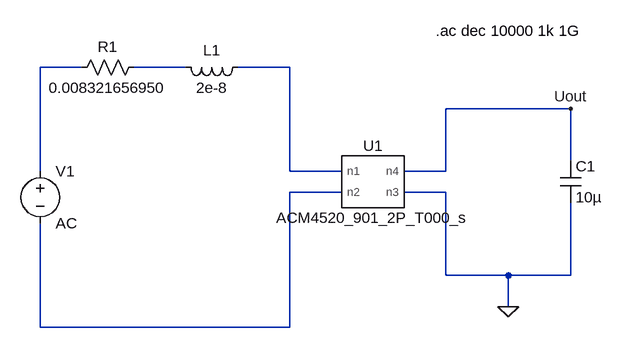
[diagram p0: schematic 01_DM-Filter_REAL.asc]
01_DM-Filter_REAL.asc, the LTspice schematic file:
Version 4
SHEET 1 1288 680
WIRE -240 -128 -304 -128
WIRE -80 -128 -160 -128
WIRE 80 -128 0 -128
WIRE 512 -64 320 -64
WIRE 512 16 512 -64
WIRE -304 32 -304 -128
WIRE 80 32 80 -128
WIRE 160 32 80 32
WIRE 320 32 320 -64
WIRE 320 32 256 32
WIRE 160 64 80 64
WIRE 320 64 256 64
WIRE 320 192 320 64
WIRE 416 192 320 192
WIRE 512 192 512 80
WIRE 512 192 416 192
WIRE 416 240 416 192
WIRE -304 272 -304 112
WIRE 80 272 80 64
WIRE 80 272 -304 272
FLAG 416 240 0
FLAG 512 -64 Uout
SYMBOL voltage -304 16 R0
SYMATTR InstName V1
SYMATTR Value AC
SYMBOL cap 496 16 R0
SYMATTR InstName C1
SYMATTR Value 10µ
SYMATTR SpiceLine V=50 Irms=0 Rser=0.0034 Lser=799p mfg="Würth Elektronik" pn="885012108022 WCAP-CSGP 1206" type="X5R"
SYMBOL res -144 -144 R90
WINDOW 0 0 56 VBottom 2
WINDOW 3 32 56 VTop 2
SYMATTR InstName R1
SYMATTR Value 0.008321656950
SYMBOL ind 16 -144 R90
WINDOW 0 5 56 VBottom 2
WINDOW 3 32 56 VTop 2
SYMATTR InstName L1
SYMATTR Value 2e-8
SYMBOL ACM4520_901_2P_T000_s 208 48 R0
SYMATTR InstName U1
TEXT 304 -184 Left 2 !.ac dec 10000 1k 1G

The netlist it stands for:
* 01_DM-Filter_REAL.asc
V1 N001 N004 AC
C1 Uout 0 10µ V=50 Irms=0 Rser=0.0034 Lser=799p mfg="Würth Elektronik" pn="885012108022 WCAP-CSGP 1206" type="X5R"
R1 N002 N001 0.008321656950
L1 N003 N002 2e-8
XU1 N003 N004 0 Uout ACM4520_901_2P_T000_s  ; pins n1 n2 n3 n4
.ac dec 10000 1k 1G
.lib C:\Work\PraxismodulHSLU\Praxismodul\08_Auslegungen\06_Simulatonsdaten\00_Spice_Daten\acm4520_901_2p_t000_s.mod
.backanno
.end